# EAGLE design M5_Shield_RS485_V1.1 (EAGLE 9.5.2)
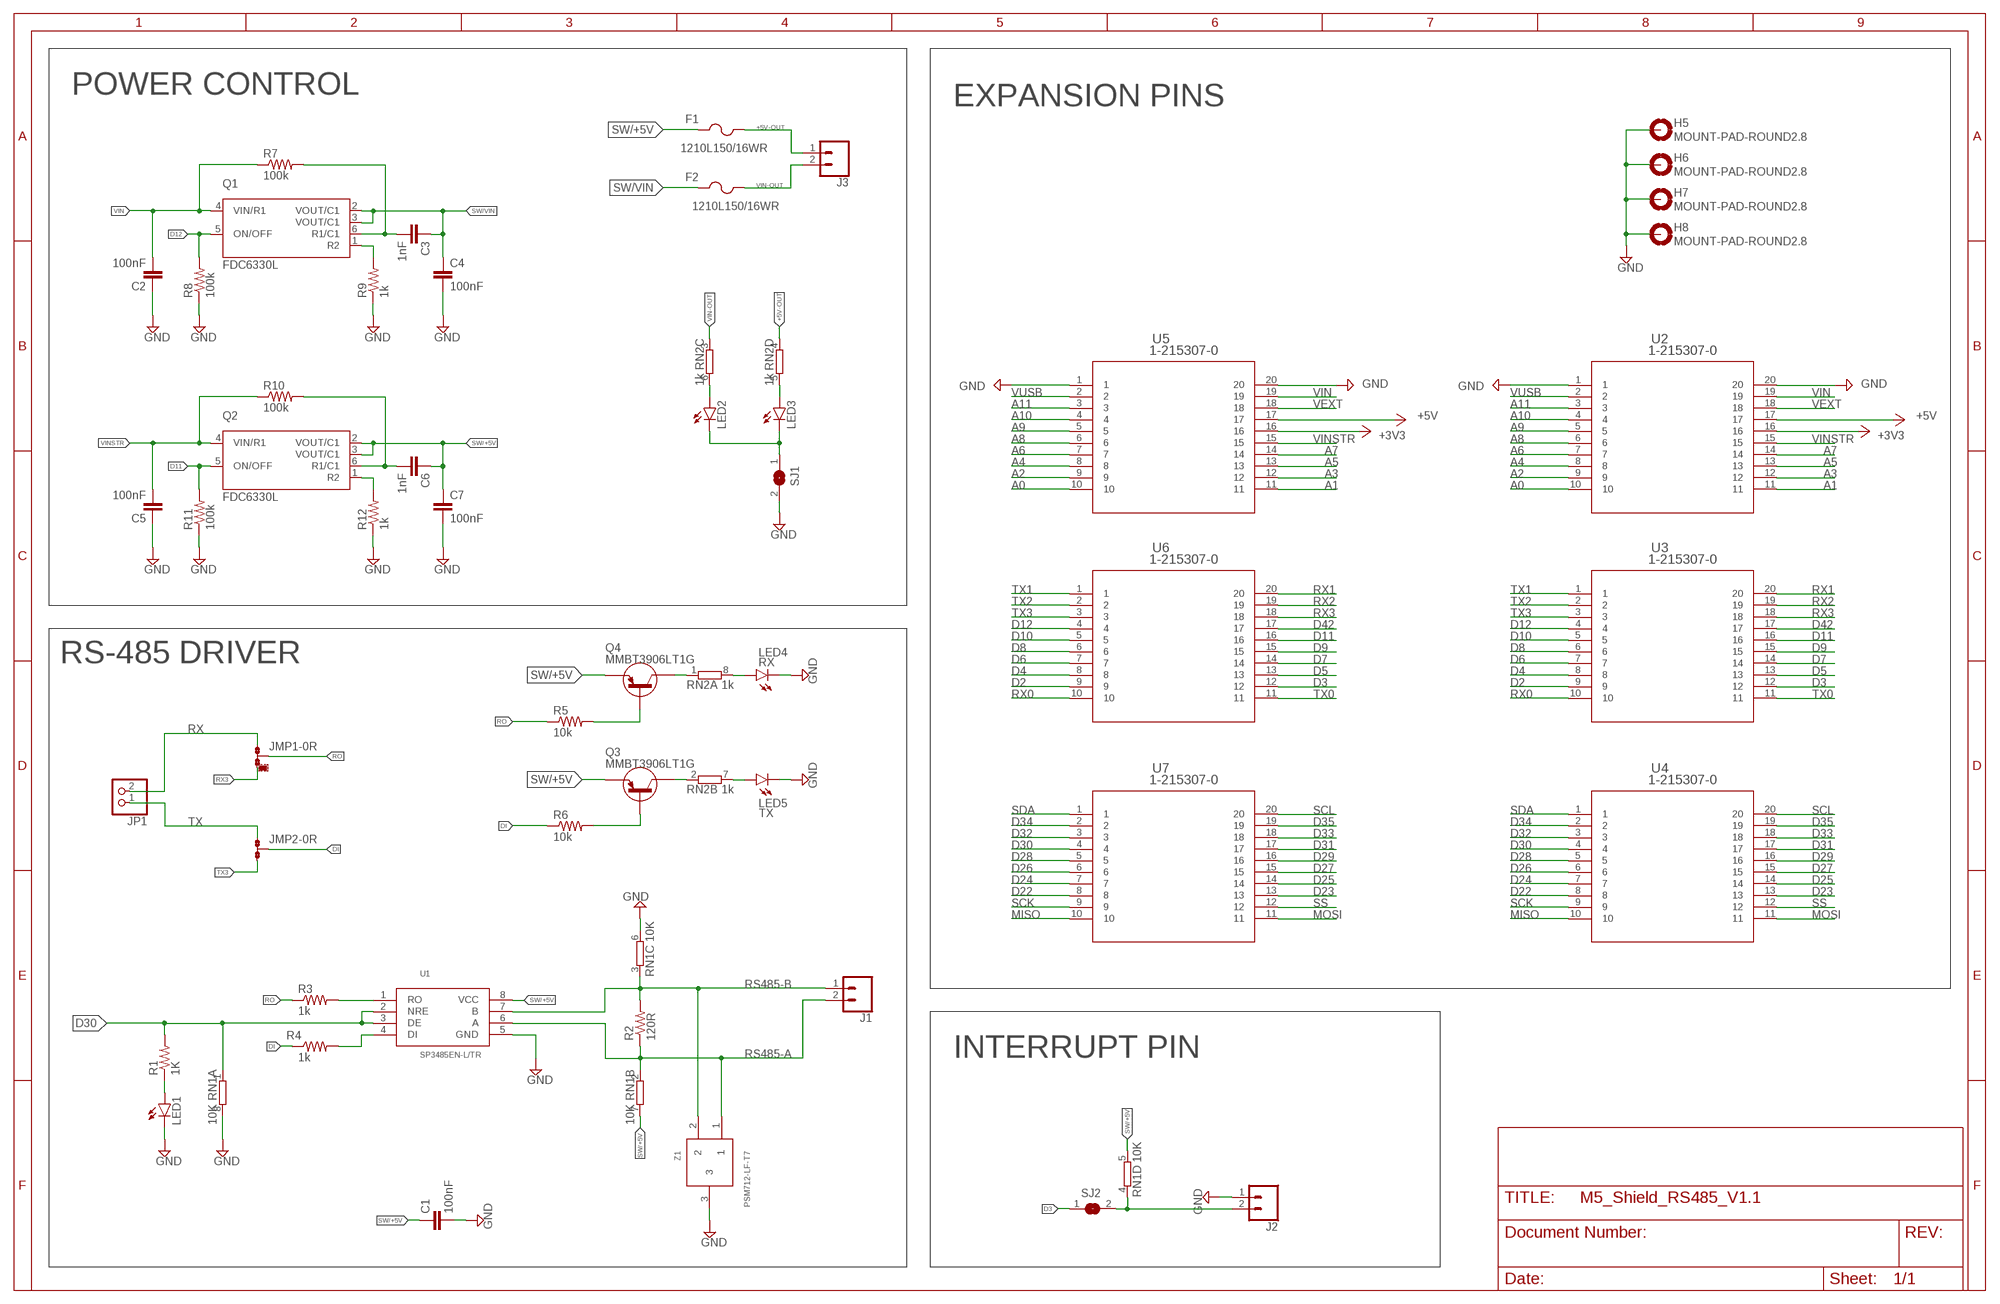
[diagram p0: schematic, sheet 1]

## Parts
C1  100nF  C-EUC0603K  [C0603K]
C2  100nF  C-EUC0603  [C0603]
C3  1nF  C-EUC0603  [C0603]
C4  100nF  C-EUC0603  [C0603]
C5  100nF  C-EUC0603  [C0603]
C6  1nF  C-EUC0603  [C0603]
C7  100nF  C-EUC0603  [C0603]
F1  1210L150/16WR  [1210LSERIES]
F2  1210L150/16WR  [1210LSERIES]
H5  MOUNT-PAD-ROUND2.8  [2,8-PAD]
H6  MOUNT-PAD-ROUND2.8  [2,8-PAD]
H7  MOUNT-PAD-ROUND2.8  [2,8-PAD]
H8  MOUNT-PAD-ROUND2.8  [2,8-PAD]
J1  CONN_023.5MM  [SCREWTERMINAL-3.5MM-2]
J2  CONN_023.5MM  [SCREWTERMINAL-3.5MM-2]
J3  CONN_023.5MM  [SCREWTERMINAL-3.5MM-2]
JMP1  0R-JUMPA  [A0R-JMP]
JMP2  0R-JUMPA  [A0R-JMP]
JP1  PINHD-1X2  [1X02]
LED1  LEDCHIPLED_0603  [CHIPLED_0603]
LED2  LEDCHIP-LED0603  [CHIP-LED0603]
LED3  LEDCHIP-LED0603  [CHIP-LED0603]
LED4  RX  LEDCHIP-LED0603  [CHIP-LED0603]
LED5  TX  LEDCHIP-LED0603  [CHIP-LED0603]
Q1  FDC6330L  [SOT95P280X110-6N]
Q2  FDC6330L  [SOT95P280X110-6N]
Q3  MMBT3906LT1G  [SOT23]
Q4  MMBT3906LT1G  [SOT23]
R1  1K  R-US_R0603  [R0603]
R2  120R  R-US_R0603  [R0603]
R3  1k  R-US_R0603  [R0603]
R4  1k  R-US_R0603  [R0603]
R5  10k  R-US_R0603  [R0603]
R6  10k  R-US_R0603  [R0603]
R7  100k  R-US_R0603  [R0603]
R8  100k  R-US_R0603  [R0603]
R9  1k  R-US_R0603  [R0603]
R10  100k  R-US_R0603  [R0603]
R11  100k  R-US_R0603  [R0603]
R12  1k  R-US_R0603  [R0603]
RN1  10K  4R-N0603-ARV  [0603-ARV]
RN2  1k  4R-N0603-ARV  [0603-ARV]
SJ1  SJ  [SJ]
SJ2  SJ  [SJ]
U1  SP3485EN-L/TR  [SP3485EN-L/TR]
U2  1-215307-0  [1-215307-0]
U3  1-215307-0  [1-215307-0]
U4  1-215307-0  [1-215307-0]
U5  1-215307-0  [1-215307-0]
U6  1-215307-0  [1-215307-0]
U7  1-215307-0  [1-215307-0]
Z1  PSM712-LF-T7  [SOT23]

## Nets
+3V3: U2.16 U5.16
+5V: U2.17 U5.17
+5V-OUT: F1.2 J3.1 RN2.4
A0: U2.10 U5.10
A1: U2.11 U5.11
A2: U2.9 U5.9
A3: U2.12 U5.12
A4: U2.8 U5.8
A5: U2.13 U5.13
A6: U2.7 U5.7
A7: U2.14 U5.14
A8: U2.6 U5.6
A9: U2.5 U5.5
A10: U2.4 U5.4
A11: U2.3 U5.3
D2: U3.9 U6.9
D3: SJ2.1 U3.12 U6.12
D4: U3.8 U6.8
D5: U3.13 U6.13
D6: U3.7 U6.7
D7: U3.14 U6.14
D8: U3.6 U6.6
D9: U3.15 U6.15
D10: U3.5 U6.5
D11: Q2.5(ON/OFF) R11.2 U3.16 U6.16
D12: Q1.5(ON/OFF) R8.2 U3.4 U6.4
D22: U4.8 U7.8
D23: U4.13 U7.13
D24: U4.7 U7.7
D25: U4.14 U7.14
D26: U4.6 U7.6
D27: U4.15 U7.15
D28: U4.5 U7.5
D29: U4.16 U7.16
D30: R1.2 RN1.1 U1.2(NRE) U1.3(DE) U4.4 U7.4
D31: U4.17 U7.17
D32: U4.3 U7.3
D33: U4.18 U7.18
D34: U4.2 U7.2
D35: U4.19 U7.19
D42: U3.17 U6.17
DI: JMP2.2 R4.1 R6.1
GND: C1.2 C2.1 C4.2 C5.1 C7.2 H5.B2,8(MOUNT) H6.B2,8(MOUNT) H7.B2,8(MOUNT) H8.B2,8(MOUNT) J2.1 LED1.C LED4.C LED5.C R8.1 R9.1 R11.1 R12.1 RN1.6 RN1.8 SJ1.2 U1.5(GND) U2.1 U2.20 U5.1 U5.20 Z1.3
MISO: U4.10 U7.10
MOSI: U4.11 U7.11
N$1: LED1.A R1.1
N$2: R3.2 U1.1(RO)
N$3: J2.2 RN1.4 SJ2.2
N$4: Q4.3(C) RN2.1
N$5: R4.2 U1.4(DI)
N$6: LED3.A RN2.5
N$7: LED2.C LED3.C SJ1.1
N$8: LED2.A RN2.6
N$9: Q3.3(C) RN2.2
N$10: LED4.A RN2.8
N$11: C6.2 Q2.6(R1/C1) R10.2
N$12: Q1.1(R2) R9.2
N$13: LED5.A RN2.7
N$14: Q4.1(B) R5.2
N$15: C3.2 Q1.6(R1/C1) R7.2
N$16: Q3.1(B) R6.2
N$17: Q2.1(R2) R12.2
RO: JMP1.2 R3.1 R5.1
RS485-A: J1.2 R2.1 RN1.2 U1.6(A) Z1.1
RS485-B: J1.1 R2.2 RN1.3 U1.7(B) Z1.2
RX: JMP1.1 JP1.2
RX0: U3.10 U6.10
RX1: U3.20 U6.20
RX2: U3.19 U6.19
RX3: JMP1.3 U3.18 U6.18
SCK: U4.9 U7.9
SCL: U4.20 U7.20
SDA: U4.1 U7.1
SS: U4.12 U7.12
SW/+5V: C1.1 C6.1 C7.1 F1.1 Q2.2(VOUT/C1) Q2.3(VOUT/C1) Q3.2(E) Q4.2(E) RN1.5 RN1.7 U1.8(VCC)
SW/VIN: C3.1 C4.1 F2.1 Q1.2(VOUT/C1) Q1.3(VOUT/C1)
TX: JMP2.1 JP1.1
TX0: U3.11 U6.11
TX1: U3.1 U6.1
TX2: U3.2 U6.2
TX3: JMP2.3 U3.3 U6.3
VEXT: U2.18 U5.18
VIN: C2.2 Q1.4(VIN/R1) R7.1 U2.19 U5.19
VIN-OUT: F2.2 J3.2 RN2.3
VINSTR: C5.2 Q2.4(VIN/R1) R10.1 U2.15 U5.15
VUSB: U2.2 U5.2

## Notes on the sheet
- POWER CONTROL
- EXPANSION PINS
- RS-485 DRIVER
- INTERRUPT PIN

## Library data of the parts
C1-C7 = rcl:C-EU: CAPACITOR, European symbol; SPICEPREFIX: C
F1 F2 = 1210L150-16WR:1210L150/16WR; BUILT_BY: EMA_UL_Team; MANUFACTURER_PART_NUMBER: 1210L150/16WR; VENDOR: Littelfuse Inc
H5-H8 = holes:MOUNT-PAD-ROUND: MOUNTING PAD, round
J1-J3 = SparkFun-Connectors:CONN_02: Multi connection point. Often used as Generic Header-pin footprint for 0.1 inch spaced/style header connections On any of the 0.1 inch spaced packages, you can populate with these: Break Away Headers - Straight <https://www.sparkfun.com/products/116> (PRT-00116) Break Away Male Headers - Right Angle <https://www.sparkfun.com/products/553> (PRT-00553) Female Headers <https://www.sparkfun.com/products/115> (PRT-00115) Break Away Headers - Machine Pin <https://www.sparkfun.com/products/117> (PRT-00117) Break Away Female Headers - Swiss Machine Pin <https://www.sparkfun.com/products/743> (PRT-00743) For SCREWTERMINALS and SPRING TERMINALS visit here: Screw Terimnals on SparkFun.com <https://www.sparkfun.com/search/results?term=Screw+Terminals> (5mm/3.5mm/2.54mm spacing) This device is also useful as a general connection point to wire up your design to another part of your project. Our various solder wires solder well into these plated through hole pads. Hook-Up Wire - Assortment (Stranded, 22 AWG) <https://www.sparkfun.com/products/11375> (PRT-11375) Hook-Up Wire - Assortment (Solid Core, 22 AWG) <https://www.sparkfun.com/products/11367> (PRT-11367) View the entire wire category on our website here <https://www.sparkfun.com/categories/141> Special notes: Molex polarized connector foot print use with: PRT-08233 with associated crimp pins and housings. 2.54_SCREWTERM for use with PRT-10571. 3.5mm Screw Terminal footprints for PRT-08084 5mm Screw Terminal footprints for use with PRT-08432; PROD_ID: CONN-08399
JMP1 JMP2 = jump-0r-smd:0R-JUMP: SMD 0R 0805 Jumper
JP1 = pinhead:PINHD-1X2: PIN HEADER
LED1-LED5 = led:LED: LED OSRAM: - CHIPLED LG R971, LG N971, LY N971, LG Q971, LY Q971, LO R971, LY R971 LH N974, LH R974 LS Q976, LO Q976, LY Q976 LO Q996 - Hyper CHIPLED LW Q18S LB Q993, LB Q99A, LB R99A - SideLED LS A670, LO A670, LY A670, LG A670, LP A670 LB A673, LV A673, LT A673, LW A673 LH A674 LY A675 LS A676, LA A676, LO A676, LY A676, LW A676 LS A679, LY A679, LG A679 - Hyper Micro SIDELED® LS Y876, LA Y876, LO Y876, LY Y876 LT Y87S - SmartLED LW L88C, LW L88S LB L89C, LB L89S, LG L890 LS L89K, LO L89K, LY L89K LS L896, LA L896, LO L896, LY L896 - TOPLED LS T670, LO T670, LY T670, LG T670, LP T670 LSG T670, LSP T670, LSY T670, LOP T670, LYG T670 LG T671, LOG T671, LSG T671 LB T673, LV T673, LT T673, LW T673 LH T674 LS T676, LA T676, LO T676, LY T676, LB T676, LH T676, LSB T676, LW T676 LB T67C, LV T67C, LT T67C, LS T67K, LO T67K, LY T67K, LW E67C LS E67B, LA E67B, LO E67B, LY E67B, LB E67C, LV E67C, LT E67C LW T67C LS T679, LY T679, LG T679 LS T770, LO T770, LY T770, LG T770, LP T770 LB T773, LV T773, LT T773, LW T773 LH T774 LS E675, LA E675, LY E675, LS T675 LS T776, LA T776, LO T776, LY T776, LB T776 LHGB T686 LT T68C, LB T68C - Hyper Mini TOPLED® LB M676 - Mini TOPLED Santana® LG M470 LS M47K, LO M47K, LY M47K Source: http://www.osram.convergy.de LUXEON: - LUMILED® LXK2-PW12-R00, LXK2-PW12-S00, LXK2-PW14-U00, LXK2-PW14-V00 LXK2-PM12-R00, LXK2-PM12-S00, LXK2-PM14-U00 LXK2-PE12-Q00, LXK2-PE12-R00, LXK2-PE12-S00, LXK2-PE14-T00, LXK2-PE14-U00 LXK2-PB12-K00, LXK2-PB12-L00, LXK2-PB12-M00, LXK2-PB14-N00, LXK2-PB14-P00, LXK2-PB14-Q00 LXK2-PR12-L00, LXK2-PR12-M00, LXK2-PR14-Q00, LXK2-PR14-R00 LXK2-PD12-Q00, LXK2-PD12-R00, LXK2-PD12-S00 LXK2-PH12-R00, LXK2-PH12-S00 LXK2-PL12-P00, LXK2-PL12-Q00, LXK2-PL12-R00 Source: www.luxeon.com KINGBRIGHT: KA-3528ASYC Source: www.kingbright.com
Q1 Q2 = FDC6330L:FDC6330L: FDC6330 Series 20 V 2.3 A High Side Integrated Load Switch - SSOT-6; DESCRIPTION: Power Switch/Driver 1:1 P-Channel 2.3A SuperSOT™-6; DIGI-KEY_PART_NUMBER: FDC6330LCT-ND; DIGI-KEY_PURCHASE_URL: https://www.digikey.com/product-detail/en/on-semiconductor/FDC6330L/FDC6330LCT-ND/1626189?utm_source=snapeda&utm_medium=aggregator&utm_campaign=symbol; MF: ON Semiconductor; MP: FDC6330L; PACKAGE: TSOT-23-6 ON Semiconductor
Q3 Q4 = MMBT3906LT1G:MMBT3906LT1G: http://octopart.com/mmbt3906lt1g.-on+semiconductor-8986246; AVAILABILITY: Unavailable; DESCRIPTION: Bipolar _BJT_ Transistor PNP 40V 200mA 250MHz 300mW Surface Mount SOT-23-3 _TO-236_; MF: ON Semiconductor; MP: MMBT3906LT1G; PACKAGE: SOT-23-3 Motorola; PRICE: None
R1-R12 = rcl:R-US_: RESISTOR, American symbol; SPICEPREFIX: R
RN1 RN2 = resistor-dil:4R-N: Array Chip Resistor Source: RS Component / Phycomp; OC_FARNELL: unknown; OC_NEWARK: unknown
SJ1 SJ2 = jumper:SJ: SMD solder JUMPER
U1 = SP3485EN-L TR:SP3485EN-L/TR
U2-U7 = 1-215307-0:1-215307-0; BUILT_BY: EMA_UL_Team; MANUFACTURER_PART_NUMBER: 1-215307-0; VENDOR: TE Connectivity
Z1 = PSM712-LF-T7:PSM712-LF-T7

## Board
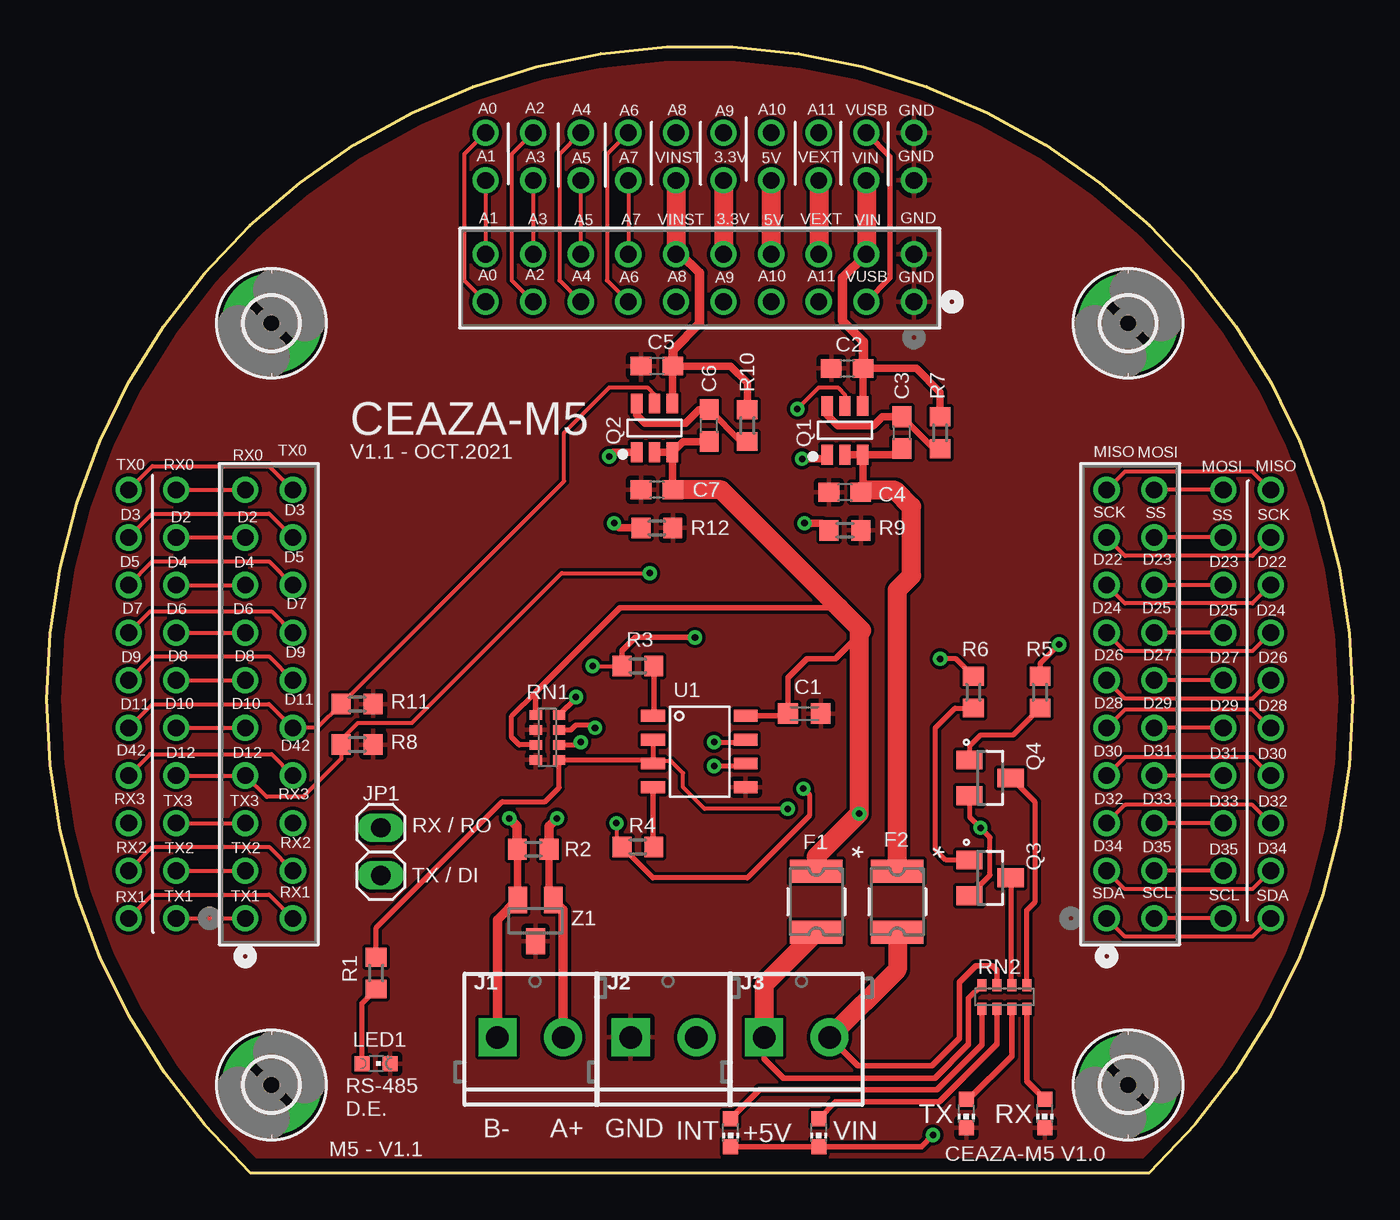
[diagram p1: board, top side]
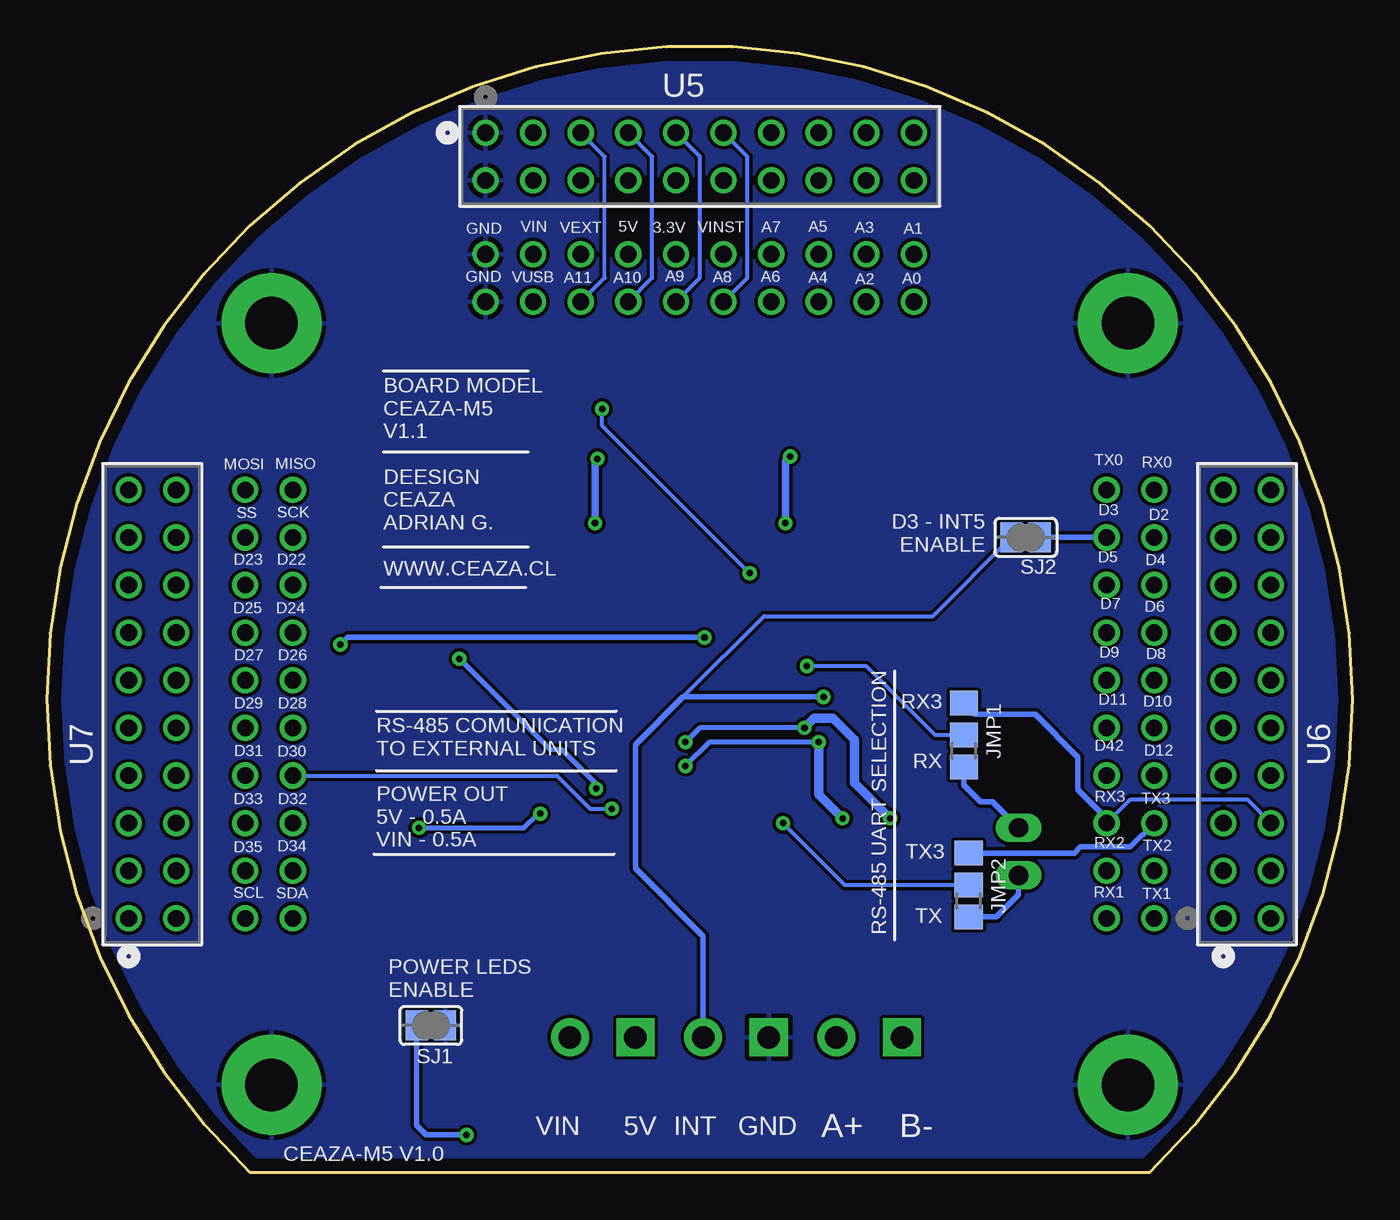
[diagram p2: board, bottom side, seen from below]

Size 69.69 x 60.06 mm. Coordinates in mm from the lower left corner, seen from the top.
Outline: 10.85,0 58.85,0 arc273 10.85,0
Copper layers (1*16): Top 0.035mm / dielectric 1.5mm / Bottom 0.035mm
Design rules "default": minimum track width 8mil, minimum drill 16mil, track to track 7mil, track to pad 7mil, pad to pad 8mil, via to via 10mil, smd to smd 7mil, copper to edge 27mil, drill to drill 12mil, minimum pad ring 10mil, minimum via ring 8mil, stop-mask expansion 2mil, vias tented up to drill 24mil, thermal gap 10mil

### Footprints (pad centres in the part's own frame; a part is rotated, then mirrored left to right if it is on the bottom)
C0603K = smd 1.05 x 1.08: 1 -0.875,0; 2 0.875,0
C0603 = smd 1.1 x 1: 1 -0.85,0; 2 0.85,0
1210LSERIES = smd 1.219 x 2.794: 1 -1.626,0; 2 1.626,0
2,8-PAD = drill 2.8 pad 5.334: B2,8 0,0
SCREWTERMINAL-3.5MM-2 = drill 1.2 pad 2.032 square: 1 0,0 | drill 1.2 pad 2.032: 2 3.5,0
A0R-JMP = smd 1.5 x 1.3: 1 0,1.7; 2 0,0; 3 0,-1.7
1X02 = drill 1.016 long: 1 -1.27,0; 2 1.27,0
CHIPLED_0603 = smd 0.8 x 0.8: A 0,-0.75; C 0,0.75
CHIP-LED0603 = smd 0.8 x 0.8: A 0,-0.75; C 0,0.75
SOT95P280X110-6N = smd 1.05 x 0.6: 1 -1.3,0.95; 2 -1.3,0; 3 -1.3,-0.95; 4 1.3,-0.95; 5 1.3,0; 6 1.3,0.95
SOT23 = smd 1.4 x 1: 1 -1.1,0.95; 2 -1.1,-0.95; 3 1.1,0
R0603 = smd 1 x 1.1: 1 -0.85,0; 2 0.85,0
0603-ARV = smd 0.5 x 0.65: 1 -1.2,-0.625; 2 -0.4,-0.625; 3 0.4,-0.625; 4 1.2,-0.625; 5 1.2,0.625; 6 0.4,0.625; 7 -0.4,0.625; 8 -1.2,0.625
SJ = smd 1.168 x 1.6: 1 -0.762,0; 2 0.762,0
SP3485EN-L/TR = smd 1.27 x 0.635: 1 -2.5,1.91; 2 -2.5,0.64; 3 -2.5,-0.63; 4 -2.5,-1.9; 5 2.45,-1.9; 6 2.45,-0.63; 7 2.45,0.64; 8 2.45,1.91
1-215307-0 = drill 0.889 pad 1.397: 1 -22.86,2.54; 2 -20.32,2.54; 3 -17.78,2.54; 4 -15.24,2.54; 5 -12.7,2.54; 6 -10.16,2.54; 7 -7.62,2.54; 8 -5.08,2.54; 9 -2.54,2.54; 10 0,2.54; 11 0,0; 12 -2.54,0; 13 -5.08,0; 14 -7.62,0; 15 -10.16,0; 16 -12.7,0; 17 -15.24,0; 18 -17.78,0; 19 -20.32,0; 20 -22.86,0
SOT23' = smd 1 x 1.4: 1 -0.95,-1.1; 2 0.95,-1.1; 3 0,1.1

### Placement (x,y rotation side)
C1  40.43,24.49 0 top
C2  42.72,42.91 0 top
C3  45.64,39.48 90 top
C4  42.59,36.3 180 top
C5  32.56,43.03 0 top
C6  35.35,39.86 90 top
C7  32.56,36.43 180 top
F1  41.07,14.46 270 top
F2  45.39,14.46 270 top
H5  57.71,45.32 0 top
H6  11.99,45.32 0 top
H7  11.99,4.68 0 top
H8  57.71,4.68 0 top
J1  24.05,7.22 0 top
J2  31.16,7.22 0 top
J3  38.27,7.22 0 top
JMP1  20.75,23.35 180 bottom
JMP2  20.49,15.35 180 bottom
JP1  17.83,17.13 90 top
LED1  17.57,5.82 270 top
LED2  41.2,2.14 180 top
LED3  36.5,2.14 180 top
LED4  53.26,3.16 180 top
LED5  49.07,3.16 180 top
Q1  42.59,39.6 90 top
Q2  32.43,39.73 90 top
Q3  50.34,15.73 0 top
Q4  50.34,21.06 0 top
R1  17.57,10.65 90 top
R2  25.96,17.25 180 top
R3  31.54,27.03 0 top
R4  31.54,17.38 0 top
R5  53.01,25.63 270 top
R6  49.45,25.63 270 top
R7  47.67,39.48 270 top
R8  16.56,22.84 180 top
R9  42.59,34.27 180 top
R10  37.39,39.86 270 top
R11  16.56,25 180 top
R12  32.56,34.4 180 top
RN1  26.72,23.22 90 top
RN2  51.1,9.38 180 top
SJ1  49.2,7.86 0 bottom
SJ2  17.45,33.89 180 bottom
U1  34.85,22.46 0 top
U2  23.42,49 180 top
U3  13.13,36.43 90 top
U4  59.1,36.43 90 top
U5  23.42,52.94 0 bottom
U6  4.37,36.43 90 bottom
U7  62.79,36.43 90 bottom
Z1  PSM712-LF-T7  [SOT23']  26.08,13.44 180 top

### Tracks (layer width: path | path; a pad name or v marks a point on that pad's centre or on a via)
+3V3
  Top 1.016: U5.16 U2.16
+5V
  Top 1.016: U5.17 U2.17
+5V-OUT
  Top 0.305: RN2.4 49.2,9.3 49.2,6.84 47.39,5.04 39.32,5.04 38.27,6.08 J3.1
  Top 1.016: F1.2 38.27,10.04 J3.1
A0
  Top 0.203: U5.10 22.27,54.34 22.27,47.61 U2.10
A1
  Top 0.203: U5.11 U2.11
A2
  Top 0.203: U5.9 24.81,54.34 24.81,47.61 U2.9
A3
  Top 0.203: U5.12 U2.12
A4
  Top 0.203: U5.8 27.35,54.34 27.35,47.61 U2.8
A5
  Top 0.203: U5.13 U2.13
A6
  Top 0.203: U5.7 29.89,54.34 29.89,47.61 U2.7
A7
  Top 0.203: U5.14 U2.14
A8
  Bottom 0.203: U2.6 32.31,47.73 32.31,54.21 U5.6
A9
  Bottom 0.203: U2.5 34.85,47.73 34.85,54.21 U5.5
A10
  Bottom 0.203: U2.4 37.39,47.73 37.39,54.21 U5.4
A11
  Bottom 0.203: U2.3 39.93,47.73 39.93,54.21 U5.3
D2
  Top 0.203: U6.9 U3.9
D3
  Top 0.203: U6.12 5.64,35.16 11.86,35.16 U3.12
  Bottom 0.305: SJ2.1 U3.12
D4
  Top 0.203: U6.8 U3.8
D5
  Top 0.203: U6.13 5.64,32.62 11.86,32.62 U3.13
D6
  Top 0.203: U6.7 U3.7
D7
  Top 0.203: U6.14 5.51,29.95 11.99,29.95 U3.14
D8
  Top 0.203: U6.6 U3.6
D9
  Top 0.203: U6.15 5.64,27.54 11.86,27.54 U3.15
D10
  Top 0.203: U6.5 U3.5
D11
  Top 0.203: U6.16 5.64,25 11.86,25 U3.16 14.44,23.73 R11.2 27.61,36.9 27.61,39.48 30.02,41.89 32.05,41.89 32.43,41.51 Q2.5
D12  (via drill 0.35)
  Top 0.203: 15.45,22.59 R8.2 | v32.18,31.98 27.48,31.98 19.48,23.98 16.6,23.98 15.71,23.09 R8.2 | v40.05,40.75 41.2,41.89 42.21,41.89 42.59,41.51 Q1.5 | U6.4 U3.4 11.73,20.05 13.68,20.05 15.71,22.08 R8.2
  Bottom 0.203: v32.18,31.98 40.05,39.86 v40.05,40.75
D22
  Top 0.203: U4.8 57.54,30.37 64.35,30.37 U7.8
D23
  Top 0.203: U7.13 U4.13
D24
  Top 0.203: U4.7 57.54,27.83 64.35,27.83 U7.7
D25
  Top 0.203: U7.14 U4.14
D26
  Top 0.203: U4.6 57.54,25.29 64.35,25.29 U7.6
D27
  Top 0.203: U7.15 U4.15
D28
  Top 0.203: U4.5 57.54,24.71 64.35,24.71 U7.5
D29
  Top 0.203: U7.16 U4.16
D30  (via drill 0.35)
  Top 0.203: U4.4 57.54,22.17 64.35,22.17 U7.4 | v39.54,19.41 35.1,19.41 33.96,20.55 33.96,21.32 33.32,21.95 32.35,21.95
  Top 0.254: U1.2 32.35,21.95 U1.3 32.15,22.02 RN1.1 27.34,20.55 26.59,19.79 24.3,19.79 17.57,13.06 R1.2
  Bottom 0.203: U4.4 42.47,21.19 40.69,19.41 v39.54,19.41
D31
  Top 0.203: U7.17 U4.17
D32
  Top 0.203: U4.3 57.54,19.63 64.35,19.63 U7.3
D33
  Top 0.203: U7.18 U4.18
D34
  Top 0.203: U4.2 57.54,15.13 64.35,15.13 U7.2
D35
  Top 0.203: U7.19 U4.19
D42
  Top 0.203: U6.17 5.51,22.33 11.99,22.33 U3.17
DI  (via drill 0.35)
  Top 0.203: v30.4,18.65 30.4,17.67 R4.1
  Top 0.254: R6.1 48.52,27.41 v47.67,27.41 | v40.38,20.49 40.69,20.17 40.69,19.03 37.39,15.73 32.34,15.73 R4.1
  Bottom 0.203: JMP2.2 27.1,15.35 v30.4,18.65
  Bottom 0.254: v47.67,27.41 42.85,22.59 42.21,22.59 40.38,20.75 v40.38,20.49
GND
  pour Top: -4.52,42.78 -4.52,13.57 10.72,-1.67 60.25,-1.67 70.41,8.49 70.41,40.24 48.82,61.83 25.96,61.83 14.53,61.83
  pour Bottom: -1.98,42.78 -1.98,11.03 11.99,-2.94 60.25,-2.94 67.87,4.68 70.41,7.22 70.41,41.51 50.09,61.83 19.61,61.83 17.07,61.83
MISO
  Top 0.203: U4.10 57.54,37.41 64.35,37.41 U7.10
MOSI
  Top 0.203: U7.11 U4.11
N$1
  Top 0.254: LED1.A 16.82,9.05 R1.1
N$2
  Top 0.305: R3.2 32.39,24.42 U1.1
N$3  (via drill 0.35)
  Top 0.305: RN1.4 28.24,25.32 v28.24,25.38
  Bottom 0.203: SJ2.2 22.4,29.7 31.42,29.7 35.73,25.38
  Bottom 0.305: v28.24,25.38 35.73,25.38 38.27,22.84 38.27,16.24 34.66,12.62 J2.2
N$4
  Top 0.254: RN2.1 52.3,14.01 52.75,14.46 52.75,19.75 Q4.3
N$5
  Top 0.305: U1.4 32.35,17.43 R4.2
N$6
  Top 0.305: LED3.A 38.03,4.43 47.51,4.43 49.9,6.82 RN2.5
N$7  (via drill 0.35)
  Top 0.305: LED3.C LED2.C 46.67,1.39 v47.29,2.01
  Bottom 0.305: v47.29,2.01 49.45,2.01 49.96,2.52 SJ1.1
N$8
  Top 0.305: LED2.A 42.1,3.79 47.63,3.79 50.7,6.86 RN2.6
N$9
  Top 0.254: Q3.3 51.44,10.07 RN2.2
N$10
  Top 0.305: LED4.A 52.3,4.87 RN2.8
N$11
  Top 0.305: R10.2 37.05,39.01 C6.2
  Top 0.406: C6.2 34.81,40.71 34.08,39.99 31.92,39.99 31.48,40.43 Q2.6
N$12  (via drill 0.35)
  Top 0.406: Q1.1 41.74,38.2 41.62,38.08 v40.31,38.08 | R9.2 41.36,34.65 v40.43,34.65
  Bottom 0.406: v40.43,34.65 40.43,37.95 v40.31,38.08
N$13
  Top 0.305: RN2.7 51.5,6.21 49.2,3.91 LED5.A
N$14
  Top 0.254: R5.2 51.57,23.35 49.83,23.35 49.24,22.76 Q4.1
N$15
  Top 0.305: R7.2 47.34,38.63 C3.2
  Top 0.406: C3.2 44.59,40.33 44.12,39.86 42.21,39.86 41.64,40.43 Q1.6
N$16
  Top 0.254: Q3.1 47.99,16.68 47.42,17.25 47.42,23.73 48.47,24.79 R6.2
N$17  (via drill 0.35)
  Top 0.406: R12.2 30.53,34.4 v30.27,34.65 | v30.02,38.21 30.24,38.43 Q2.1
  Bottom 0.406: v30.27,34.65 30.27,37.95 v30.02,38.21
RO  (via drill 0.35)
  Top 0.203: v29.13,27.03 R3.1
  Top 0.254: v54.02,28.17 53.01,27.16 R5.1
  Top 0.305: R3.1 30.69,27.83 31.42,28.56 v34.59,28.56
  Bottom 0.203: JMP1.2 22.27,23.35 25.96,27.03 v29.13,27.03
  Bottom 0.305: v34.59,28.56 53.64,28.56 v54.02,28.17
RS485-A  (via drill 0.35)
  Top 0.254: RN1.2 28.35,22.82 v28.5,22.97 | v35.61,21.7 37.16,21.7 U1.6
  Top 0.406: Z1.1 26.81,14.77 R2.1
  Top 0.508: Z1.1 27.55,14.02 J1.2 | R2.1 26.81,18.48 v27.23,18.9
  Bottom 0.254: v28.5,22.97 34.34,22.97 v35.61,21.7
  Bottom 0.508: v27.23,18.9 28.5,20.17 v28.5,22.97
RS485-B  (via drill 0.35)
  Top 0.254: RN1.3 27.97,23.62 28.22,23.88 29.11,23.88 v29.26,23.73 | v35.61,22.97 37.16,22.97 U1.7
  Top 0.406: Z1.2 25.13,14.59 25.13,17.23 R2.2
  Top 0.508: J1.1 24.05,13.5 25.13,14.59 | R2.2 25.11,18.48 v24.69,18.9
  Bottom 0.254: v29.26,23.73 34.85,23.73 v35.61,22.97
  Bottom 0.508: v24.69,18.9 26.59,20.81 26.59,23.09 27.73,24.24 28.75,24.24 v29.26,23.73
RX
  Bottom 0.305: JP1.2 19.22,19.79 19.86,19.79 20.75,20.68 JMP1.1
RX0
  Top 0.203: U6.10 U3.10
RX1
  Top 0.203: U6.20 5.64,14.84 11.86,14.84 U3.20
RX2
  Top 0.203: U6.19 5.64,17.38 11.86,17.38 U3.19
RX3
  Bottom 0.203: U3.18 13,18.78 11.86,19.92 5.64,19.92 U6.18
  Bottom 0.305: JMP1.3 20.16,24.46 16.94,24.46 14.65,22.17 14.65,20.43 13,18.78
SCK
  Top 0.203: U4.9 57.54,32.91 64.35,32.91 U7.9
SCL
  Top 0.203: U7.20 U4.20
SDA
  Top 0.203: U4.1 57.54,12.59 64.35,12.59 U7.1
SS
  Top 0.203: U7.12 U4.12
SW/+5V  (via drill 0.35)
  Top 0.254: RN1.7 25.21,22.82 24.81,23.22 24.81,24.36 26.09,25.65 | Q4.2 49.24,18.99 v49.83,18.4 50.34,17.89 50.34,15.88 Q3.2
  Top 0.305: U1.8 39.44,24.37 C1.1 39.56,26.41 40.56,27.41 42.08,27.41 43.48,28.81 43.48,28.94 | RN1.5 26.09,25.65 30.59,30.14 42.28,30.14
  Top 0.406: C6.1 33.96,39.01 Q2.3 | Q2.2 Q2.3 | Q2.3 33.38,36.46 C7.1
  Top 1.016: C7.1 35.99,36.43 42.28,30.14 43.48,28.94 43.35,28.81 v43.35,19.16 41.07,16.87 F1.1
  Bottom 0.254: v49.83,18.4 44.24,18.4 43.48,19.16 v43.35,19.16
SW/VIN
  Top 0.406: C3.1 45.32,38.3 Q1.3 | Q1.3 Q1.2 | Q1.3 43.54,36.4 C4.1
  Top 1.016: 43.54,36.4 45.29,36.4 46.15,35.54 46.15,31.86 45.39,31.1 F2.1
TX
  Bottom 0.305: JP1.1 17.83,14.84 19.02,13.65 JMP2.1
TX0
  Top 0.203: U6.11 5.64,37.7 11.86,37.7 U3.11
TX1
  Top 0.203: U6.1 U3.1
TX2
  Top 0.203: U6.2 U3.2
TX3
  Top 0.203: U6.3 U3.3
  Bottom 0.305: JMP2.3 14.86,17.05 14.53,17.38 11.86,17.38 U3.3
VEXT
  Top 1.016: U5.18 U2.18
VIN
  Top 0.406: Q1.4 43.54,42.88 C2.2 46.4,42.91 47.67,41.64 R7.1
  Top 0.508: C2.2 43.57,44.34 42.47,45.45 42.47,47.73 U2.19
  Top 1.016: 43.61,42.95 C2.2 | U5.19 U2.19
VIN-OUT
  Top 0.305: RN2.3 50.7,10.8 50.47,11.03 49.58,11.03 48.71,10.17 48.71,7.17 47.24,5.7 43.3,5.7 J3.2
  Top 1.016: F2.2 45.39,10.83 J3.2
VINSTR
  Top 0.406: Q2.4 33.38,43.01 C5.2 36.5,43.03 37.39,42.15 R10.1
  Top 0.508: C5.2 33.41,43.88 34.83,45.31 34.83,48 33.83,49 U2.15
  Top 1.016: U5.15 U2.15
VUSB
  Top 0.305: U2.2 45.01,47.73 45.01,54.21 U5.2

### Text on the board
tPlace: CEAZA-M5 | V1.1 - OCT.2021 | RX / RO | TX / DI | RS-485 / D.E. | B- | A+ | GND | INT | VIN | TX | RX | M5 - V1.1 | +5V | CEAZA-M5 V1.0
bPlace: D3 - INT5 / ENABLE | BOARD MODEL / CEAZA-M5 / V1.1 / / DEESIGN / CEAZA / ADRIAN G. / / WWW.CEAZA.CL | RX3 | RX | RS-485 COMUNICATION / TO EXTERNAL UNITS / / POWER OUT / 5V - 0.5A / VIN - 0.5A | TX3 | TX | RS-485 UART SELECTION | POWER LEDS / ENABLE | B- | A+ | GND | INT | 5V | VIN | CEAZA-M5 V1.0
tNames: A0 | A2 | A4 | A6 | A8 | A9 | A10 | A11 | VUSB | GND | A1 | A3 | A5 | A7 | VINST | 3.3V | 5V | VEXT | VIN | GND | A1 | A3 | A5 | A7 | VINST | 3.3V | 5V | VEXT | VIN | GND | A0 | A2 | A4 | A6 | A8 | A9 | A10 | A11 | VUSB | GND | RX0 | TX0 | MISO | MOSI | TX0 | RX0 | MOSI | MISO | D3 | D3 | SCK | SS | SS | SCK | D2 | D2 | D5 | D4 | D4 | D5 | D22 | D23 | D23 | D22 | D7 | D6 | D6 | D7 | D24 | D25 | D25 | D24 | D9 | D8 | D8 | D9 | D26 | D27 | D27 | D26 | D11 | D11 | D10 | D10 | D28 | D29 | D29 | D28 | D42 | D12 | D12 | D42 | D30 | D31 | D31 | D30 | RX3 | RX3 | TX3 | TX3 | D32 | D33 | D33 | D32 | RX2 | TX2 | TX2 | RX2 | D34 | D35 | D35 | D34 | RX1 | TX1 | TX1 | RX1 | SDA | SCL | SCL | SDA
bNames: A5 | A7 | VINST | 5V | VIN | A1 | A3 | 3.3V | VEXT | GND | A0 | A2 | A4 | A6 | A8 | A9 | A10 | A11 | VUSB | GND | RX0 | TX0 | MISO | MOSI | D2 | D3 | SCK | SS | D4 | D5 | D22 | D23 | D6 | D7 | D24 | D25 | D8 | D9 | D26 | D27 | D10 | D11 | D28 | D29 | D12 | D42 | D30 | D31 | RX3 | TX3 | D32 | D33 | TX2 | RX2 | D34 | D35 | TX1 | RX1 | SDA | SCL